# Altium schematic sheet Power budget.SchDoc
size A2; Author: İlker KESER; Revision: V1.0; SheetNumber: 2; SheetTotal: 9; Page: 2; Page Total: 9; Project Code: 02050838; Template: A2
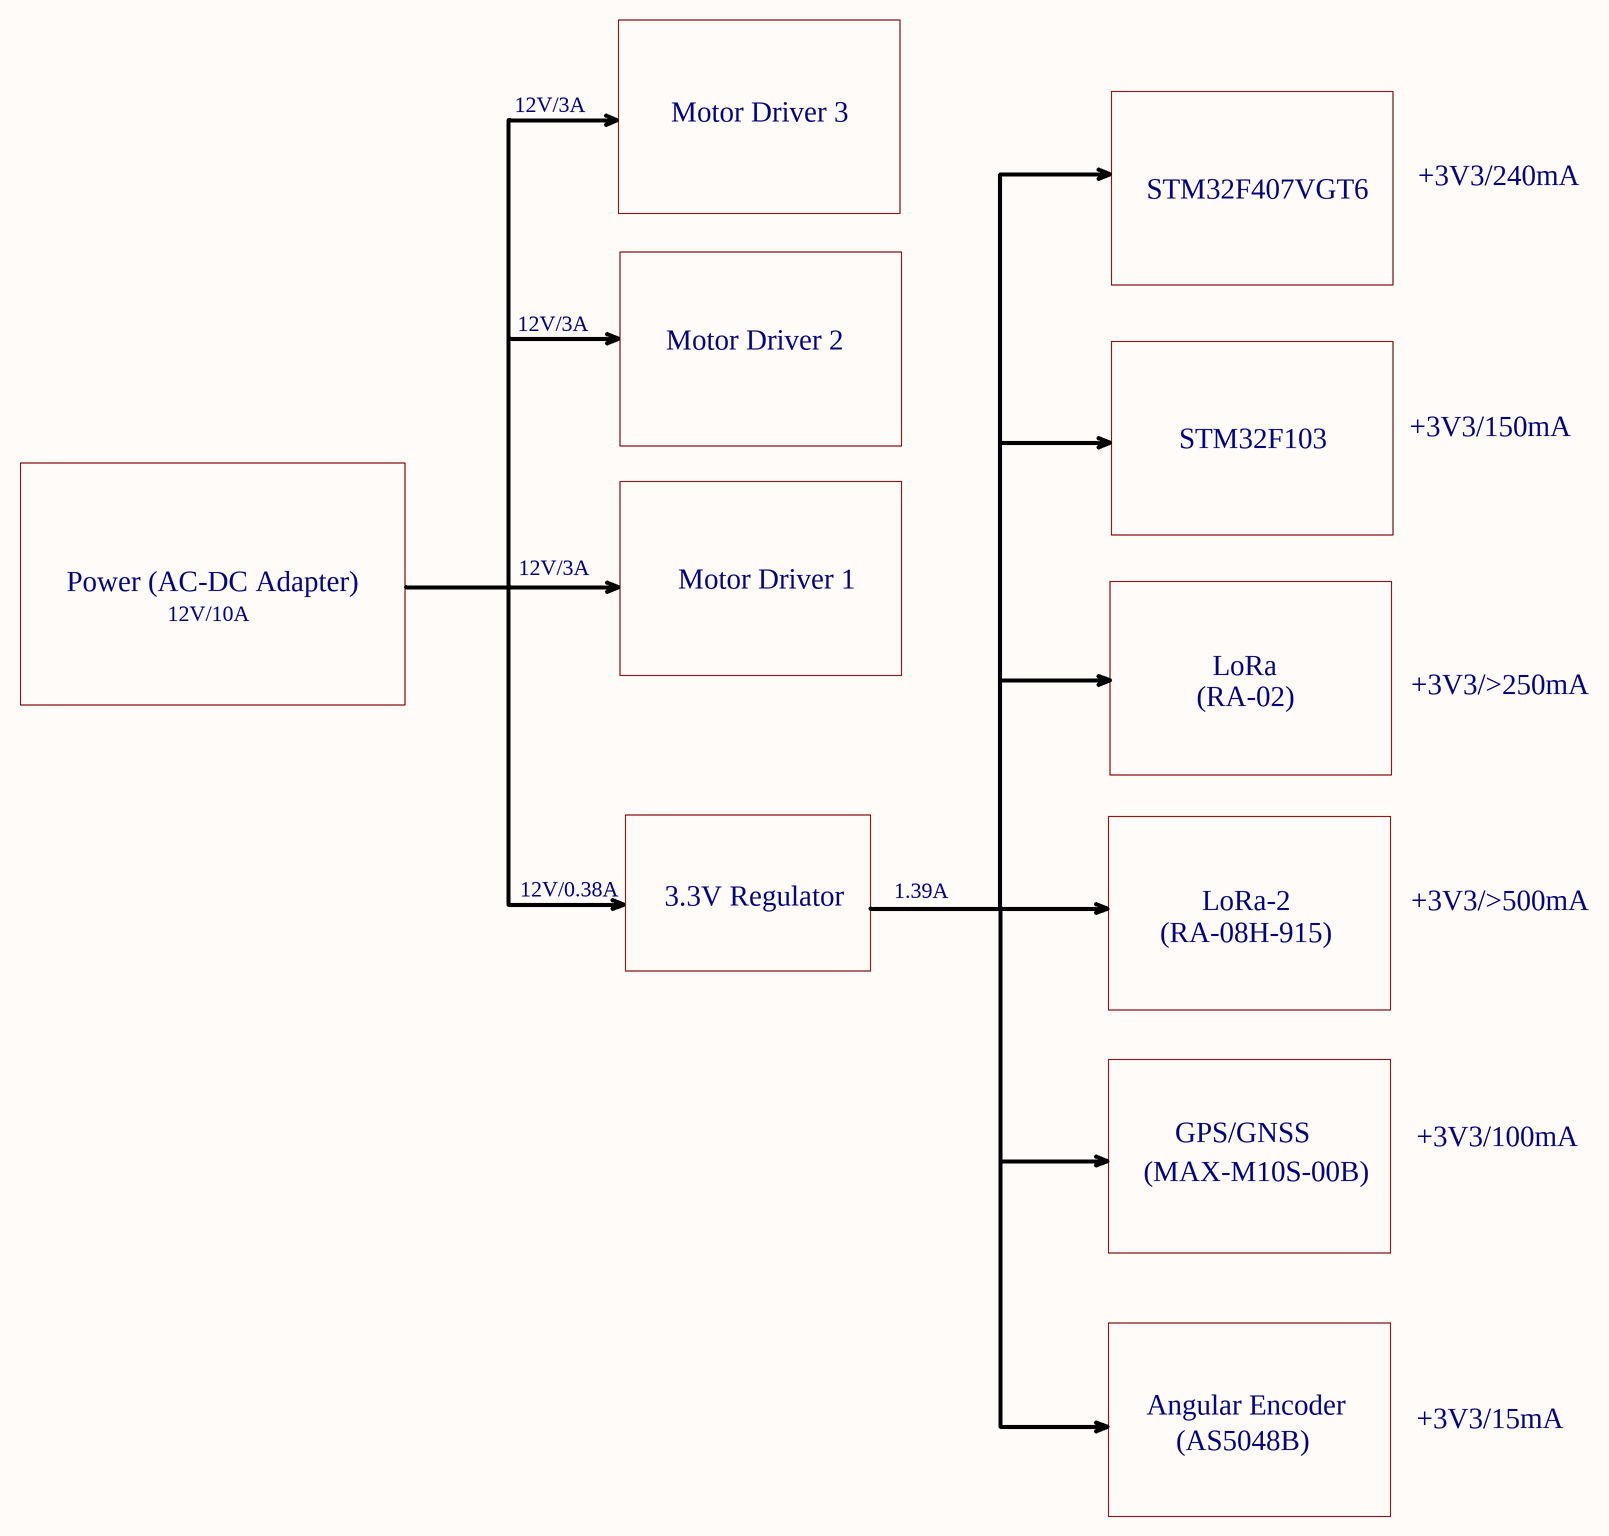
[diagram p0: Power budget.SchDoc]

## Notes on the sheet
- 12V/3A
- Motor Driver 3
- STM32F407VGT6
- +3V3/240mA
- Motor Driver 2
- STM32F103
- +3V3/150mA
- Power (AC-DC Adapter)
- 12V/10A
- Motor Driver 1
- LoRa
- +3V3/>250mA
- (RA-02)
- 12V/0.38A
- 1.39A
- 3.3V Regulator
- (RA-08H-915)
- LoRa-2
- +3V3/>500mA
- GPS/GNSS
- +3V3/100mA
- (MAX-M10S-00B)
- Angular Encoder
- +3V3/15mA
- (AS5048B)
- TITLE:
- DOCUMENT NAME:
- PROJECT CODE:
- TEMPLATE:
- AUTHOR:
- REVISION:
- Sheet:
- of